# EAGLE board Mtx12BR (EAGLE 7.5.0)
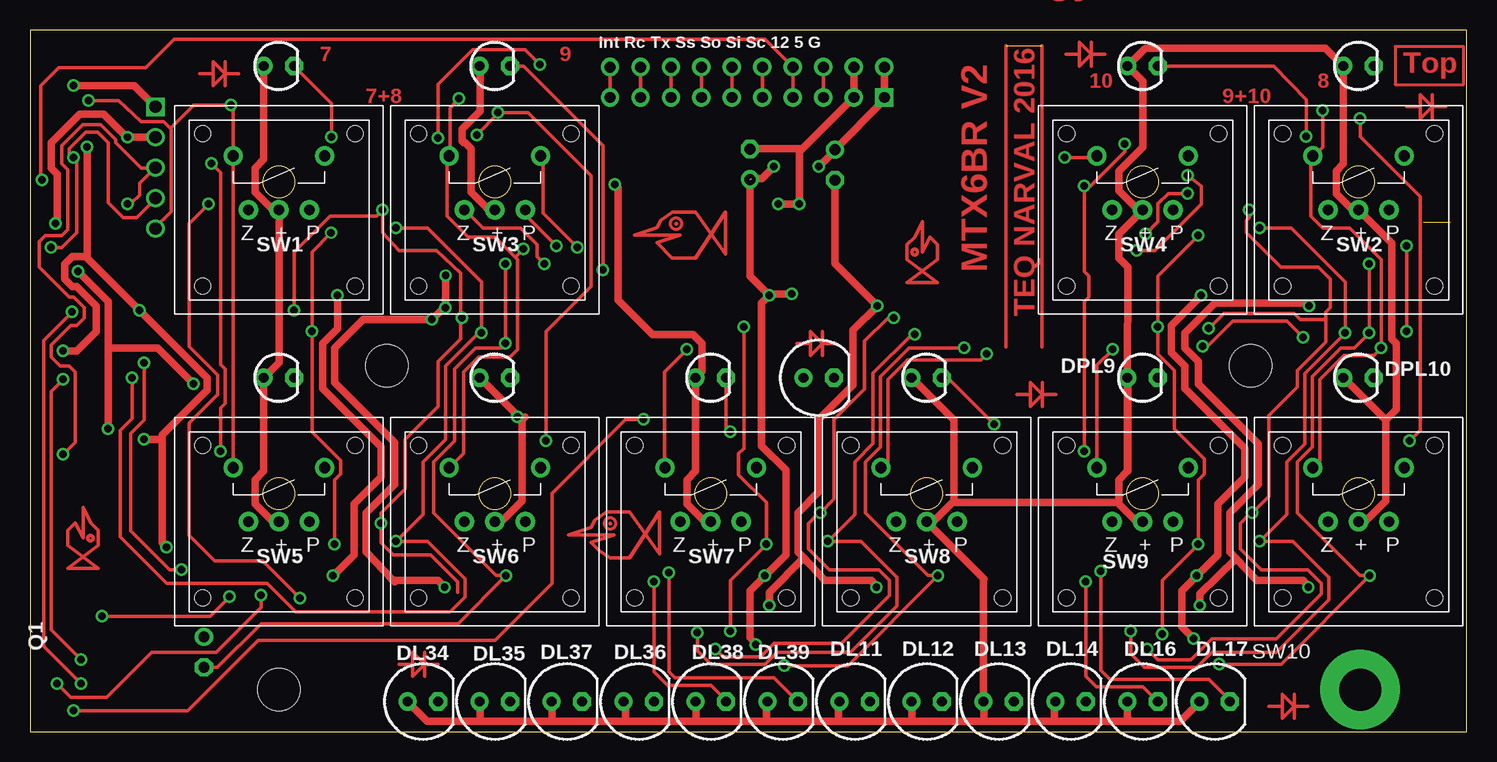
[diagram p2: board, top side]
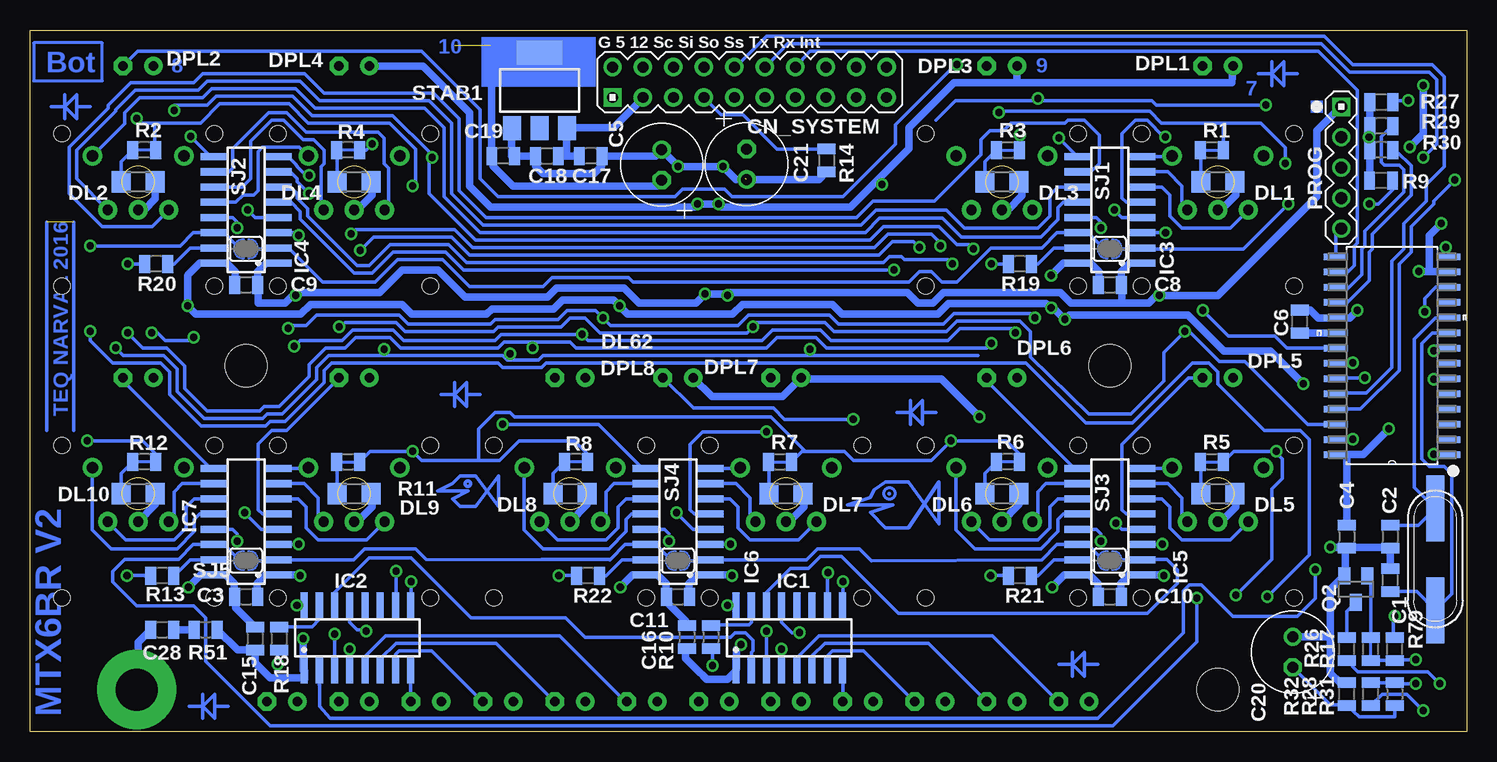
[diagram p3: board, bottom side, seen from below]

Size 119.75 x 58.5 mm. Coordinates in mm from the lower left corner, seen from the top.
Outline: 0,0 119.75,0 119.75,58.5 0,58.5 0,0
Outline: circle at 56.75,19.84 radius 1.33
Outline: circle at 38.75,19.84 radius 1.33
Outline: circle at 74.75,19.84 radius 1.33
Outline: circle at 20.75,19.84 radius 1.33
Outline: circle at 110.75,45.84 radius 1.33
Outline: circle at 38.75,45.84 radius 1.33
Outline: circle at 92.75,19.84 radius 1.33
Outline: circle at 20.75,45.84 radius 1.33
Outline: circle at 92.75,45.84 radius 1.33
Outline: circle at 110.75,19.84 radius 1.33
Copper layers (1*16): Top 0.035mm / dielectric 1.5mm / Bottom 0.035mm
Design rules "default": minimum track width 10mil, minimum drill 23mil, track to track 12mil, track to pad 12mil, pad to pad 12mil, via to via 12mil, smd to smd 0mil, copper to edge 12mil, drill to drill 8mil, minimum pad ring 10mil, minimum via ring 8mil, stop-mask expansion 0mil, vias tented up to drill 0mil, thermal gap 10mil
Net classes: 0 default: width 0.305 mm, clearance 0.305 mm; 1 Tap: width 0.406 mm, clearance 0.305 mm
Holes 3.5 mm at 29.75,30.5 20.75,3.5 101.75,30.5
tRestrict: area 98.2,27 to 105.2,34; area 26.2,27 to 33.2,34; area 17.2,0 to 24.2,7
bRestrict: area 98.2,27 to 105.2,34; area 26.2,27 to 33.2,34; area 17.2,0 to 24.2,7

## Footprints (pad centres in the part's own frame; a part is rotated, then mirrored left to right if it is on the bottom)
R0805 = smd 0.9 x 1.5: 1 -0.953,0; 2 0.953,0
C_EL1RASZT07 = drill 0.914 pad 1.524 octagon: P+ 1.27,0 | drill 0.914 pad 1.524: P- -1.27,0
TESTCSAVAR_3.5 = drill 3.5 pad 6.6: P$1 0,0
PIN10_2 = drill 0.914 pad 1.524 square: 1 -10.16,0 | drill 0.914 pad 1.524: 2 -10.16,2.54; 3 -7.62,0; 4 -7.62,2.54; 5 -5.08,0; 6 -5.08,2.54; 7 -2.54,0; 8 -2.54,2.54; 9 0,0; 10 0,2.54; 11 2.54,0; 12 2.54,2.54; 13 5.08,0; 14 5.08,2.54; 15 7.62,0; 16 7.62,2.54; 17 10.16,0; 18 10.16,2.54; 19 12.7,0; 20 12.7,2.54
R1206 = smd 1.6 x 1.803: 1 -1.422,0; 2 1.422,0
LED5MM = drill 0.813 pad 1.524: A -1.27,0 | drill 0.813 pad 1.524 octagon: K 1.27,0
LED3MM = drill 0.813 pad 1.524: A -1.27,0 | drill 0.813 pad 1.524 octagon: K 1.27,0
SO16 = smd 0.6 x 2.2: 1 -4.445,-2.695; 2 -3.175,-2.695; 3 -1.905,-2.695; 4 -0.635,-2.695; 5 0.635,-2.695; 6 1.905,-2.695; 7 3.175,-2.695; 8 4.445,-2.695; 9 4.445,2.695; 10 3.175,2.695; 11 1.905,2.695; 12 0.635,2.695; 13 -0.635,2.695; 14 -1.905,2.695; 15 -3.175,2.695; 16 -4.445,2.695
SOIC127P1032X265-28N = smd 1.981 x 0.533: 1 -4.699,8.255; 2 -4.699,6.985; 3 -4.699,5.715; 4 -4.699,4.445; 5 -4.699,3.175; 6 -4.699,1.905; 7 -4.699,0.635; 8 -4.699,-0.635; 9 -4.699,-1.905; 10 -4.699,-3.175; 11 -4.699,-4.445; 12 -4.699,-5.715; 13 -4.699,-6.985; 14 -4.699,-8.255; 15 4.699,-8.255; 16 4.699,-6.985; 17 4.699,-5.715; 18 4.699,-4.445; 19 4.699,-3.175; 20 4.699,-1.905; 21 4.699,-0.635; 22 4.699,0.635; 23 4.699,1.905; 24 4.699,3.175; 25 4.699,4.445; 26 4.699,5.715; 27 4.699,6.985; 28 4.699,8.255
PIN05_1 = drill 1.016 square: 1 -5.08,0 | drill 1.016: 2 -2.54,0; 3 0,0; 4 2.54,0; 5 5.08,0
XTAL_NAGYSMD = smd 5.5 x 1.5: P$1 -4.25,0; P$2 4.25,0
SOT23 = smd 1 x 1.4: 1 -0.95,-1.1; 2 0.95,-1.1; 3 0,1.1
R0805_C = smd 0.9 x 1.5: 1 -0.953,0; 2 0.953,0
SJ = smd 0.508 x 0.508: 1 -0.762,0; 2 0.762,0; 3 -0.762,0; 4 0.762,0
SOT223 = smd 1.5 x 2: 1 -2.3,-3.15; 2 0,-3.15; 3 2.3,-3.15 | smd 3.8 x 2: 4 0,3.15
SPG2_3LED = drill 0.95 pad 1.6: G1 -3.81,4.5; G2 3.81,4.5 | drill 0.85 pad 1.6: LED+ 0,0; P- 2.54,0; Z- -2.54,0 | hole 1.35: 6.35,6.35; -6.35,6.35; -6.35,-6.35; 6.35,-6.35

## Placement (x,y rotation side)
C1  22  [R0805]  6.38,12.62 90 bottom
C2  22  [R0805]  6.38,16.25 270 bottom
C3  100n  [R0805]  101.75,11.25 0 bottom
C4  100n  [R0805]  10,16.25 270 bottom
C5  100u  [C_EL1RASZT07]  67.1,47.26 270 bottom
C6  1u  [R0805]  13.92,34.19 90 bottom
C8  100n  [R0805]  29.75,37.25 0 bottom
C9  100n  [R0805]  101.75,37.25 0 bottom
C10  100n  [R0805]  29.75,11.25 0 bottom
C11  100n  [R0805]  65.75,11.25 0 bottom
C15  100n  [R0805]  101,7.75 270 bottom
C16  100n  [R0805]  65,7.88 270 bottom
C17  100n  [R0805]  73.02,48 180 bottom
C18  1u  [R0805]  76.67,48 0 bottom
C19  1u  [R0805]  80.32,48 180 bottom
C20  220u  [C_EL1RASZT07]  14.5,6.62 270 bottom
C21  100u  [C_EL1RASZT07]  60.02,47.3 90 bottom
C28  100n  [R0805]  108.75,8.5 0 bottom
CN1  TESTCSAVAR3.5  [TESTCSAVAR_3.5]  110.88,3.5 0 top
CN_SYSTEM  G 5 12 Sc Si So Ss Tx Rc Int  [PIN10_2]  61.05,52.88 0 bottom
DL1  LED1206  [R1206]  20.75,45.84 180 bottom
DL2  LED1206  [R1206]  110.75,45.84 180 bottom
DL3  LED1206  [R1206]  38.75,45.84 180 bottom
DL4  LED1206  [R1206]  92.75,45.84 180 bottom
DL5  LED1206  [R1206]  20.75,19.84 180 bottom
DL6  LED1206  [R1206]  38.75,19.84 180 bottom
DL7  LED1206  [R1206]  56.75,19.84 180 bottom
DL8  LED1206  [R1206]  74.75,19.84 180 bottom
DL9  LED1206  [R1206]  92.75,19.84 180 bottom
DL10  LED1206  [R1206]  110.75,19.84 180 bottom
DL11  Red  [LED5MM]  68.75,2.5 0 top
DL12  Red  [LED5MM]  74.75,2.5 0 top
DL13  Red  [LED5MM]  80.75,2.5 0 top
DL14  Red  [LED5MM]  86.75,2.5 0 top
DL16  Red  [LED5MM]  92.75,2.5 0 top
DL17  Red  [LED5MM]  98.75,2.5 0 top
DL34  Red  [LED5MM]  32.75,2.5 0 top
DL35  Red  [LED5MM]  38.75,2.5 0 top
DL36  Red  [LED5MM]  44.75,2.5 0 top
DL37  Red  [LED5MM]  50.75,2.5 0 top
DL38  Red  [LED5MM]  56.75,2.5 0 top
DL39  Red  [LED5MM]  62.75,2.5 0 top
DL62  PWR  [LED5MM]  65.75,29.5 0 top
DPL1  LED3MM  [LED3MM]  20.75,55.5 0 top
DPL2  LED3MM  [LED3MM]  110.75,55.5 0 top
DPL3  LED3MM  [LED3MM]  38.75,55.5 0 top
DPL4  LED3MM  [LED3MM]  92.75,55.5 0 top
DPL5  LED3MM  [LED3MM]  20.75,29.5 0 top
DPL6  LED3MM  [LED3MM]  38.75,29.5 0 top
DPL7  LED3MM  [LED3MM]  56.75,29.5 0 top
DPL8  LED3MM  [LED3MM]  74.75,29.5 0 top
DPL9  LED3MM  [LED3MM]  92.75,29.5 0 top
DPL10  LED3MM  [LED3MM]  110.75,29.5 0 top
IC1  SCT2168SOP16  [SO16]  56.47,7.83 0 bottom
IC2  SCT2168SOP16  [SO16]  92.47,7.83 0 bottom
IC3  SCT2168SOP16  [SO16]  29.75,43.5 90 bottom
IC4  SCT2168SOP16  [SO16]  101.75,43.5 90 bottom
IC5  SCT2168SOP16  [SO16]  29.75,17.5 90 bottom
IC6  SCT2168SOP16  [SO16]  65.75,17.5 90 bottom
IC7  SCT2168SOP16  [SO16]  101.75,17.5 90 bottom
PIC1  PIC32MX1XXSOIC  [SOIC127P1032X265-28N]  6.22,31.34 180 bottom
PROG  G +5 M 39 40  [PIN05_1]  10.46,47.02 270 bottom
Q1  20MHz  [XTAL_NAGYSMD]  2.62,14.38 270 bottom
Q2  BC846BSMD  [SOT23]  9.25,11.88 180 bottom
R1  [R0805_C]  21.25,48.5 0 bottom
R2  [R0805_C]  110.25,48.5 180 bottom
R3  [R0805_C]  38.25,48.5 0 bottom
R4  [R0805_C]  93.25,48.5 180 bottom
R5  [R0805_C]  21.25,22.5 0 bottom
R6  [R0805_C]  38.25,22.5 180 bottom
R7  [R0805_C]  57.25,22.5 0 bottom
R8  [R0805_C]  74.25,22.5 180 bottom
R9  2k2  [R0805]  7.14,45.95 180 bottom
R10  2.2k  [R0805]  63,7.88 270 bottom
R11  [R0805_C]  93.25,22.5 0 bottom
R12  [R0805_C]  110.25,22.5 180 bottom
R13  2.2k  [R0805]  108.75,13 180 bottom
R14  220  [R0805]  53.36,47.62 270 bottom
R17  [R0805_C]  8,6.88 90 bottom
R18  2.2k  [R0805]  99,7.75 270 bottom
R19  [R0805]  37.25,39 180 bottom
R20  NOP  [R0805]  109.25,39 180 bottom
R21  [R0805]  37.25,13 180 bottom
R22  [R0805]  73.25,13 180 bottom
R26  [R0805]  10,6.88 90 bottom
R27  4.7k  [R0805]  7.12,52.5 0 bottom
R28  10k  [R0805]  8,3.12 90 bottom
R29  2.2k  [R0805]  7.12,50.5 180 bottom
R30  2.2k  [R0805]  7.12,48.5 180 bottom
R31  330  [R0805]  6,3.12 270 bottom
R32  150  [R0805]  10,3.12 90 bottom
R51  2k2  [R0805]  105.12,8.5 0 bottom
R79  2.2k  [R0805]  6,6.88 90 bottom
SJ1  [SJ]  29.75,40.25 180 bottom
SJ2  [SJ]  101.75,40.25 180 bottom
SJ3  [SJ]  29.75,14.25 180 bottom
SJ4  [SJ]  65.75,14.25 180 bottom
SJ5  [SJ]  101.75,14.25 180 bottom
STAB1  LD117AS33TR  [SOT223]  77.29,53.47 0 bottom
SW1  SPG2  [SPG2_3LED]  20.75,43.5 0 top
SW2  SPG2  [SPG2_3LED]  110.75,43.5 0 top
SW3  SPG2  [SPG2_3LED]  38.75,43.5 0 top
SW4  SPG2  [SPG2_3LED]  92.75,43.5 0 top
SW5  SPG2  [SPG2_3LED]  20.75,17.5 0 top
SW6  SPG2  [SPG2_3LED]  38.75,17.5 0 top
SW7  SPG2  [SPG2_3LED]  56.75,17.5 0 top
SW8  SPG2  [SPG2_3LED]  74.75,17.5 0 top
SW9  SPG2  [SPG2_3LED]  92.75,17.5 0 top
SW10  SPG2  [SPG2_3LED]  110.75,17.5 0 top

## Tracks (layer width: path | path; a pad name or v marks a point on that pad's centre or on a via)
+3V3  (via drill 0.61)
  Top 0.61: 106.62,35.34 106.63,35.33 v106.63,35.49 v106.62,35.5 106.38,35.75 98.75,35.75 96.25,33.25 96.25,32 97.38,30.88 97.38,29 102.38,24 102.38,20.62 100,18.25 100,15 100.56,14.41 | 64.43,14.54 66.25,12.62 70.12,12.62 70.56,12.06 v70.56,12.03 | 64.43,14.54 64,15 64,18.25 65.74,19.99 65.74,26.03 68.6,28.89 68.6,33.48 v70.62,35.5 | 34.62,35.5 34.62,38.03 v34.65,38.03 34.59,38.03 | 34.62,35.5 v34.62,35.34 v34.63,35.33 | 34.62,35.5 v33.5,34.38 27.75,34.38 25.38,32 25.38,29.12 30.38,24.12 30.38,20.62 28,18.25 28,15 30.25,12.62 | 30.25,12.62 34,12.62 34.56,12.06 v34.56,12.03 | 30.38,12.5 30.25,12.62 | v6.5,25.25 6.5,32 | 6.5,32 6.5,35.88 v4,38.38 | PROG.2 v8.13,49.55 v8.12,49.55 8.12,49.5 6.12,51.5 4.12,51.5 1.75,49.12 1.75,47 2.25,46.5 2.25,42.5 2.12,42.5 v2.12,42.38 | 70.62,35.34 70.63,35.33 v70.63,35.49 v70.62,35.5 | 100.56,14.41 102.25,12.62 106.12,12.62 106.56,12.06 v106.56,12.03 | 70.62,35.38 v70.62,35.5 | v97.52,10.52 97.5,10.5 97.5,11.5 100.54,14.41 100.56,14.41 | v61.62,10.52 61.62,11.62 64.43,14.43 64.43,14.54 | C5.P+ 67.1,39.02 v70.62,35.5 | v13.62,29 10.62,32 6.5,32
  Bottom 0.406: C11.1 66.7,11.2 66.62,11.12 | 65.12,9.25 65.12,8.95 C16.1
  Bottom 0.61: C9.1 102.68,38.35 103.38,39.05 IC4.16 105.62,39.05 106.52,38.16 106.62,38.03 v106.62,35.5 | C11.1 66.75,12.35 67.46,13.05 IC6.16 69.54,13.05 v70.56,12.03 70.59,12 70.62,12 | IC1.16 v61.62,10.52 | 65.12,8.86 C16.1 | 97,10.5 96.99,10.49 IC2.16 v97.52,10.52 | 106.5,35.33 106.63,35.37 v106.63,35.51 v106.62,35.5 | 30.68,37.25 30.68,37.2 30.75,37.13 30.75,37.12 | 30.68,37.25 30.68,38.35 31.38,39.05 IC3.16 33.62,39.05 v34.65,38.03 | 30.75,11.21 30.75,11.25 | 30.75,11.25 30.75,12.35 31.46,13.05 IC5.16 33.54,13.05 v34.56,12.03 34.53,12 34.5,12 | 35.06,35.69 43.19,35.69 44.06,34.81 52.06,34.81 52.88,35.62 60.38,35.62 61.19,34.81 69.94,34.81 v70.62,35.5 v70.63,35.51 | 35.06,35.69 34.63,35.37 | 34.63,35.37 v34.63,35.33 | C8.1 30.68,37.25 | C10.1 30.75,11.25 | 35.06,35.69 34.69,35.31 | PIC1.28 10.88,23.12 9.88,23.12 | 9.88,23.12 8.62,23.12 v6.5,25.25 | 3.12,38.38 3.12,41.38 v2.12,42.38 | PIC1.13 1.58,38.38 3.12,38.38 | 3.12,38.38 v4,38.38 | 8.08,49.5 R29.2 R27.1 | 8.08,49.5 8.08,48.55 | 8.08,48.55 8.25,48.38 | v8.13,49.55 8.08,49.5 | R9.2 8.08,45.96 R30.2 8.08,48.55 | C4.1 10,23 9.88,23.12 | v106.62,35.5 105.94,34.81 97.19,34.81 96.38,35.62 88.75,35.62 87.94,34.81 81.69,34.81 81.25,35.25 76.12,35.25 75.38,36 71.12,36 v70.63,35.51 | 34.63,35.37 34.62,35.38 34.5,35.38 v33.5,34.38 33.12,34.75 23.25,34.75 20.25,31.75 16.38,31.75 v13.62,29 | 70.5,35.33 70.63,35.37 v70.63,35.51 | 106.62,12 106.59,12 v106.56,12.03 105.54,13.05 IC7.16 103.46,13.05 102.75,12.35 C3.1 102.7,11.2 102.62,11.12 | 65.12,9.25 66.62,10.75 66.62,11.12 66.62,11.25 | C15.1 102.62,10.33 102.62,11.12 | 102.62,11.12 102.62,11.25
  Bottom 0.61: C5.P+ 67.12,46 67.5,45.5 79.5,45.5 81.15,47.15 C19.2 81.27,55.98 80.62,56.62 77.28,56.62 | 77.25,56.62 77.28,56.62 | 77.28,56.62 STAB1.4
+5V  (via drill 0.61)
  Top 0.61: SW7.LED+ 56.25,17.5 54.75,19 54.75,21 55.48,21.73 DPL7.A 56,30.02 56,32.38 55.25,33.12 51.88,33.12 49,35.98 49,45.38 v48.75,45.62 | 76.88,19.12 77,19.25 77,26 73.5,29.5 | 76.88,19.12 75.25,17.5 SW8.LED+ 79.5,12.75 79.48,12.73 DL13.A 79.5,2.48 79.5,0.88 | 73.5,29.62 73.5,29.5 | 73.5,29.5 DPL8.A | SW5.LED+ 20.25,17.5 18.75,19 18.75,21 19.48,21.73 DPL5.A 20.75,30.77 SW1.LED+ 20.25,43.5 18.75,45 18.75,47 19.48,47.73 DPL1.A | SW6.LED+ 39.25,17.5 41,19.25 41,26 41.25,26.25 v40.62,26.25 40.38,26.5 40.38,26.62 37.5,29.5 DPL6.A | CN_SYSTEM.4 CN_SYSTEM.3 68.62,52.88 64.25,48.5 64.12,48.62 | 90.75,19.12 90.75,21 91.48,21.73 DPL9.A | 90.75,19.12 90.75,19 92.25,17.5 SW9.LED+ | SW10.LED+ 111.25,17.5 113,19.25 113,26 | 109.5,29.62 109.5,29.5 | 109.5,29.5 113,26 | 109.5,29.5 DPL10.A | 37.5,0.88 33.1,0.88 DL34.A | 37.5,0.88 43.5,0.88 | 43.5,0.88 49.62,0.88 | 49.62,0.88 55.5,0.88 | 55.5,0.88 61.38,0.88 | 61.38,0.88 67.38,0.88 | 67.38,0.88 73.5,0.88 | 73.5,0.88 79.5,0.88 | 79.5,0.88 85.38,0.88 | 85.38,0.88 91.75,0.88 | 91.75,0.88 95.88,0.88 97.5,2.5 DL17.A | DL14.A 85.38,2.4 85.38,0.88 | DL12.A 73.5,2.48 73.5,0.88 | DL11.A 67.38,2.4 67.38,0.88 | DL39.A 61.38,2.4 61.38,0.88 | DL38.A 55.5,2.48 55.5,0.88 | DL37.A 49.62,2.35 49.62,0.88 | DL36.A 43.5,2.48 43.5,0.88 | DL35.A 37.5,2.48 37.5,0.88 | DL16.A 91.48,1.15 91.75,0.88 | 113,26 113.88,26.88 113.88,32.38 113.5,32.75 113.5,40.75 SW2.LED+ 110.25,43.5 108.88,44.88 108.88,46.75 109.48,47.35 DPL2.A 107.98,57 93,57 92.88,56.9 DPL4.A 91.5,55.5 92.75,54.25 92.75,48.75 90.75,46.75 90.75,45.12 92.12,43.75 92.5,43.75 SW4.LED+ 90.75,41.5 90.75,39.5 91.5,38.75 DPL9.A
  Top 0.61: v62.38,44 v64.12,44 64.12,48.62 | 64.12,48.62 60,48.62 60,48.6 C21.P+ | 90.75,19.12 76.88,19.12 | DPL9.A 91.5,29.48 91.5,21.75 | SW3.LED+ 38.25,43.5 36.75,45 36.75,48.62 36.25,49.12 36.12,49.12 36,49.25 36,50.25 37.5,51.75 37.5,55.5 DPL3.A
  Bottom 0.305: DL7.1 55.25,19.92 | DL1.1 19.25,45.92 | DL5.1 19.25,19.92 | DL9.1 91.25,19.92
  Bottom 0.61: STAB1.3 74.6,50.08 | C18.2 75.12,48 | 75.12,48 C17.2 74.22,48.18 | STAB1.3 74.99,49.84 74.99,49.95 75.05,49.85 | STAB1.3 74.99,50.29 | 91.25,45.92 91.25,44.75 92.5,43.5 SW4.LED+ | 55.25,19.92 55.25,18.75 56.5,17.5 SW7.LED+ | DL8.1 73.33,18.92 SW8.LED+ | 75.05,49.85 75.01,50.04 | 19.25,45.92 19.25,44.75 20.5,43.5 SW1.LED+ | 19.25,19.92 19.25,18.75 20.5,17.5 SW5.LED+ | 37.12,54.11 19.57,54.11 19.48,55.15 DPL1.A | DL6.1 37.33,18.92 SW6.LED+ | 37.5,54.11 42.76,54.11 46.5,50.38 46.5,48.62 49.25,45.88 | 37.5,54.11 37.12,54.11 | 68.62,52.88 CN_SYSTEM.3 68.67,52.83 71.12,50.38 74.93,50.38 STAB1.3 | 75.12,50.25 75.06,50.31 STAB1.3 | 75.05,49.85 75.05,48.08 75.12,48 | 30.88,54.12 37.11,54.12 37.12,54.11 | 91.25,19.92 91.25,19.62 | 91.25,19.62 91.25,18.75 92.5,17.5 SW9.LED+ | DL10.1 109.33,18.92 SW10.LED+ | 91.5,55.5 DPL4.A 87,55.5 83.12,51.62 83.12,45.5 81.38,43.75 64.38,43.75 v64.12,44 v62.38,44 62.12,43.75 51.38,43.75 49.25,45.88 | v48.75,45.62 49.12,45.88 49.25,45.88 | DL2.1 109.33,44.42 110.25,43.5 SW2.LED+ | SW3.LED+ 38.25,43.5 37.06,44.69 37.06,45.58 DL3.1 | DPL3.A 37.48,54.13 37.5,54.11 | 40.62,26.38 v40.62,26.25 43.78,29.41 55.38,29.41 DPL7.A 57.04,27.94 62.92,27.94 DL62.A | DL10.1 | DL9.1 91.33,19.7 91.25,19.62 | 91.25,45.92 | 91.25,45.92 DL4.1
+12V
  Top 0.305: CN_SYSTEM.5 CN_SYSTEM.6
GND  (via drill 0.61)  (1 unrouted)
  Top 0.406: 61.34,12.91 v61.25,13 | 97.34,12.91 v97.25,13
  Top 0.61: v25.25,13 27,14.75 27,19 29.25,21.25 29.25,23.75 24.38,28.62 24.38,32.38 25.62,33.62 v25.62,36.38 | CN_SYSTEM.2 CN_SYSTEM.1 71.21,52.59 71.16,52.59 C5.P- 67.12,48.51 67.12,48.5 v65.75,47.12 | 97.5,36.5 v97.62,36.38 95.12,33.88 95.12,31.62 96.25,30.5 96.25,28.62 101.25,23.62 101.25,21.25 99,19 99,14.75 v97.25,13 96,11.75 96,8.75 v97,7.75 | v9.12,35.12 14.75,29.5 14.75,28.5 11,24.75 11,24.38 | v9.5,24.38 11,24.38 | v2.75,31.75 3.88,31.75 5.5,33.38 5.5,35.5 3.88,37.12 3.5,37.12 2.88,37.75 2.88,39 3.5,39.62 4.5,39.62 4.75,39.5 | 9.11,35.15 v9.12,35.12 | v9.12,35.12 4.75,39.5 | 4.75,39.5 v4.75,48.75 | PROG.1 8.68,53.88 v3.62,53.88 | 11,24.38 11,15.75 v11.38,15.38 | 61.5,36.5 v61.62,36.38 | v60.5,7.25 60,7.88 60,11.75 v61.25,13 63,14.75 63,21.79 60.98,23.81 60.98,35.73 v61.62,36.38 | v61.62,36.38 60.02,37.98 C21.P- | v63.5,36.5 61.75,36.5 v61.62,36.38 | v62,47.12 61,46.12 60.12,46.12 59.88,45.88
  Bottom 0.406: IC1.1 60.92,5.21 60.88,5.25
  Bottom 0.61: IC4.1 100.07,39.05 100.77,38.35 C9.2 100.75,37.06 100.75,35.75 98.5,35.75 97.75,36.5 | C11.2 64.85,12.35 64.14,13.05 IC6.1 61.3,13.05 v61.25,13 | 79.5,50.31 STAB1.1 79.34,50.31 79.62,50.28 79.62,48 C19.1 C18.1 77.87,48 77.62,47.83 77.62,47.14 77.01,46.53 72.74,46.53 72.13,47.14 | 72.13,47.14 72.16,47.73 C17.1 67.62,48 C5.P- 65.73,47.16 | 72.13,47.74 72.13,47.62 72.13,47.14 | C16.2 65.12,6.79 65.12,6.12 64.12,5.12 63.49,4.51 63.62,4.62 63.38,4.38 61.62,4.38 60.92,5.08 IC1.1 | C15.2 101.03,6.84 101,6.88 C15.2 | 101.14,6.75 C15.2 | 97.75,36.5 97.62,36.62 90.62,36.62 88.75,38.5 85.75,38.5 83.5,36.25 76.62,36.25 75.88,37 70.25,37 69,35.75 64.25,35.75 v63.5,36.5 61.75,36.5 v61.62,36.38 61.38,36.62 46.62,36.62 45.75,35.75 44.5,35.75 43.62,36.62 33.88,36.62 33,35.75 28.75,35.75 | v97.62,36.38 97.75,36.5 | IC3.1 28.07,39.05 28.77,38.35 28.77,37.25 | 28.77,37.25 28.77,37.2 28.75,37.06 28.75,35.75 | 28.85,11.21 28.85,11.25 | 28.85,11.25 28.85,12.35 28.14,13.05 IC5.1 25.3,13.05 v25.25,13 25.34,12.91 25.21,12.84 | 28.75,35.75 26.5,35.75 25.75,36.5 | 25.75,36.5 25.62,36.62 | 25.75,36.5 v25.62,36.38 20.75,36.38 12.5,44.62 12.5,50.12 10.5,52.12 PROG.1 | C8.2 28.77,37.25 | C10.2 28.85,11.25 | C15.2 101,5.75 99.75,4.5 97,4.5 96.88,4.38 96.88,5.06 IC2.1 97,5.12 v97,7.75 | PIC1.27 10.9,24.38 v9.5,24.38 | PIC1.8 1.55,32 2.5,32 v2.75,31.75 | v9.12,35.12 9.75,34.5 PIC1.19 12.38,34.5 13.02,35.15 C6.2 | C1.2 C2.2 6.45,15.38 10,15.38 10.06,15.31 | v4.75,48.75 3.62,49.88 v3.62,53.88 | 10.06,15.31 10.12,15.25 10.12,13.12 | 10.12,13.12 10.12,13.05 Q2.2 | R32.2 10.58,4.12 11.38,4.88 11.38,8
  Bottom 0.61: 11.38,8 11.38,11.88 10.12,13.12 | v11.38,15.38 10.08,15.38 C4.2 10.05,15.3 10.06,15.31 | C3.2 100.85,12.35 100.14,13.05 IC7.1 97.31,13.05 v97.25,13 | v60.5,7.25 60.88,6.88 60.88,5.25 | R51.2 102.47,6.8 C15.2 | C20.P- 11.48,7.89 11.38,8 | 60.91,46.03 v62,47.12 v65.75,47.12 | R14.2 54,46.03 C21.P-
HALACSKA1
  Bottom 0.305: 48.13,16.98 46.54,16.98 44,20.8 44,17.3 46.54,20.8 48.45,20.8 49.4,20.16 49.72,19.52 51.62,18.89 47.81,18.89 49.72,18.25 48.46,17 48,17
HALACSKA3
  Top 0.305: 53.87,39.48 55.46,39.48 58,43.3 58,39.8 55.46,43.3 53.55,43.3 52.6,42.66 52.28,42.02 50.38,41.39 54.19,41.39 52.28,40.76 53.54,39.5 54,39.5
HALACSKA4
  Bottom 0.305: 80.72,21.31 80.72,18.77 82.63,21.31 83.9,21.31 84.53,20.68 85.8,20.04 83.26,20.04 84.53,19.41 83.9,18.77 82.63,18.77 80.72,21.31
HALACSKA5
  Top 0.305: 52.5,18.3 52.5,14.8 49.96,18.3 48.05,18.3 47.1,17.66 46.78,17.02 44.88,16.39 48.69,16.39 46.78,15.76 47.42,15.12 48.37,14.48 49.96,14.48 52.5,18.3
HALACSKA6
  Top 0.305: 5.69,13.6 3.15,13.6 5.69,15.5 5.69,16.77 5.05,17.41 4.42,18.68 4.42,16.14 3.78,17.41 3.15,16.77 3.15,15.5 5.69,13.6
HALACSKA8
  Top 0.305: 73.12,37.44 75.66,37.44 73.12,39.34 73.12,40.62 73.75,41.25 74.39,42.52 74.39,39.98 75.02,41.25 75.66,40.62 75.66,39.34 73.12,37.44
N$1
  Bottom 0.305: PIC1.9 1.53,33.25 2.88,33.25 3.75,32.38 3.75,22.75 3.12,22.12 1.88,22.12 1.25,21.5 1.25,11.5 Q1.P$2 4.17,11.67 C1.1
N$2
  Bottom 0.305: PIC1.10 1.53,34.5 2.62,34.5 4.38,32.75 4.38,20.38 Q1.P$1 4.05,17.2 C2.1
N$3  (via drill 0.61)
  Top 0.305: v111.62,39 v111.62,33.25 110.38,32 109.25,32 106.88,29.62 106.88,23.75 105.62,22.5 105.62,18.25 110.87,13 v111.68,13 | v75.68,13 74.87,13 69.62,18.25 69.62,22.5 70.88,23.75 70.88,29.62 73.25,32 v77.88,32 | v39.62,39 v39.62,32.38 39.25,32 37.12,32 35.38,30.25 35.38,24.25 33.62,22.5 33.62,18.25 38.87,13 v39.68,13 35.68,9 19.25,9 15.61,5.36 C20.P+ | 75.75,13 v75.68,13 | 111.75,13 v111.68,13 | 62.75,5.38 v62.88,5.5 68.18,5.5 v75.68,13 | v99.12,5.62 104.3,5.62 v111.68,13
  Bottom 0.305: R20.2 v111.62,39 | R22.2 v75.68,13 | 98.83,7 R18.2 99.12,6.7 v99.12,5.62 | 62.62,6.88 62.88,7.12 63,7 | 63,7 63.12,6.88 63,6.88 | 63,6.88 R10.2 63,7 | R19.2 v39.62,39 | R21.2 v39.68,13 | 39.62,32.12 v39.62,32.38 40,32 53.38,32 54.25,32.88 57.5,32.88 58.38,32 74.25,32 74.75,32.5 77.88,32.5 | v62.88,5.5 62.88,7 63,6.88 | R31.2 6,1.25 8.95,1.25 R32.1 10.08,2.25 11.38,2.25 14.48,5.36 C20.P+ | v111.62,33.25 110.38,32 108.38,32 106.88,30.5 106.88,28.62 105,26.75 100.62,26.75 100.25,27.12 99,27.12 96.5,29.62 96.5,30.62 95.12,32 93.5,32 92.62,32.88 89.75,32.88 88.88,32 80.75,32 80.25,32.5 77.88,32.5 | v111.68,13 110.2,13 R13.2 | v77.88,32 77.88,32.5
N$4
  Bottom 0.305: IC5.8 24.61,21.95 SW5.G2
N$5
  Bottom 0.305: SW9.P- 95.29,17.54 95.75,18 95.75,19.5 96.92,20.68 IC7.7
N$6
  Bottom 0.305: IC1.5 55.84,6.16 54,8 39.52,8 DL34.K
N$7
  Bottom 0.305: SW5.P- 23.29,17.54 23.75,18 23.75,19.5 24.93,20.68 IC5.7
N$8
  Bottom 0.305: IC1.6 54.57,6.31 53.5,7.38 44.88,7.38 40.12,2.62 40.02,2.52 | 40.02,2.52 40,2.5 | DL35.K 40.02,2.52
N$9
  Bottom 0.305: Q2.1 8,12.68 R17.2
N$10
  Bottom 0.305: SW6.Z- 35.75,17.96 35.75,20 35.08,20.68 IC5.10
N$11
  Bottom 0.305: SW5.Z- 19.71,16 23.75,16 24.75,17 24.75,18.75 25.41,19.41 IC5.6
N$12
  Bottom 0.305: IC5.11 34.09,19.41 34.75,18.75 34.75,17 35.75,16 39.79,16 SW6.P-
N$13
  Bottom 0.305: SW9.Z- 91.71,16 95.75,16 96.75,17 96.75,18.75 97.41,19.41 IC7.6
N$14
  Bottom 0.305: SW6.G2 42.56,16.81 41,15.25 35.5,15.25 34.06,16.69 34.06,17.69 33.62,18.14 IC5.12
N$15
  Bottom 0.305: SW10.Z- 107.75,17.96 107.75,20 107.08,20.68 IC7.10
N$16
  Bottom 0.305: IC7.11 106.09,19.41 106.75,18.75 106.75,17 107.75,16 111.79,16 SW10.P-
N$17
  Bottom 0.305: IC5.5 28.39,18.14 28.75,18.5 28.75,23.93 23.18,29.5 DPL5.K
N$18
  Bottom 0.305: DL6.2 40.17,21.53 R6.2
N$19
  Bottom 0.305: IC5.9 32.7,21.95 40.02,29.27 DPL6.K
N$20
  Bottom 0.305: R5.1 22.17,22.47 DL5.2
N$21
  Bottom 0.305: IC2.15 95.65,9.35 96.25,8.75 98.75,8.75 98.88,8.88 98.98,8.77 R18.1
N$22
  Bottom 0.305: SW10.G2 114.56,16.81 113,15.25 107.5,15.25 106.06,16.69 106.06,17.69 105.61,18.14 IC7.12
N$23
  Bottom 0.305: R1.1 22.17,48.47 DL1.2
N$24  (via drill 0.61)
  Top 0.305: v34,49.5 34,54 36.88,56.88 41.25,56.88 v42.5,55.62
  Bottom 0.305: IC3.9 32.7,47.95 32.7,48.2 v34,49.5 | DPL2.K 110.77,56.75 87.12,56.75 82.25,51.88 82.25,46.12 80.75,44.62 66,44.62 65.38,45.25 61.88,45.25 61.25,44.62 52,44.62 47.62,49 47.62,50.62 42.62,55.62 v42.5,55.62
N$25
  Bottom 0.305: DL2.2 112.17,47.53 R2.2
N$26
  Bottom 0.305: IC7.8 96.61,21.95 SW9.G2
N$27  (via drill 0.61)
  Top 0.305: v96.5,44.88 94.88,44.88 94.03,44.03 94.03,42.53 v93,41.5 | v43.88,40.5 41.25,43.12 41.25,43.5 SW3.P-
  Bottom 0.305: IC4.7 99,46.62 98,46.62 97.5,46.12 97.5,45.88 v96.5,44.88 | v93,41.5 92.62,41.88 84.38,41.88 82.88,40.38 49.38,40.38 48.25,41.5 44.62,41.5 43.88,40.75 v43.88,40.5
N$28  (via drill 0.61)
  Top 0.305: v42.88,39 42.25,39.62 42.25,40.62 40.88,42 37.75,42 36.25,43.5 SW3.Z-
  Bottom 0.305: IC4.6 98.03,45.41 97.5,44.88 97.5,44.5 96.62,43.62 96.62,43 92.5,38.88 91.5,38.88 89.75,40.62 84.88,40.62 83.38,39.12 48.62,39.12 48.12,39.62 47.12,39.62 46.88,39.38 43.25,39.38 v42.88,39
N$29
  Bottom 0.305: SW1.P- 23.29,43.54 23.75,44 23.75,45.5 24.93,46.67 IC3.7
N$30
  Bottom 0.305: SW1.Z- 19.71,42 23.75,42 24.75,43 24.75,44.75 25.41,45.41 IC3.6
N$31
  Bottom 0.305: SW2.Z- 109.58,42.12 113.75,42.12 116.5,44.88 116.5,48.75 113.25,52 113.25,52.25 111.38,54.12 106.12,54.12 105.38,54.88 96.88,54.88 95.25,53.25 86.12,53.25 84,51.12 84,45.12 81.75,42.88 50.88,42.88 49.5,44.25 44.38,44.25 40.5,48.12 40.5,49.38 39.75,50.12 38.62,50.12 38,50.75 33.5,50.75 33.25,51 31.88,51 30.62,49.75 30.62,47.38 31.33,46.67 IC3.10
N$32
  Bottom 0.305: IC3.11 34.09,45.41 34.75,44.75 34.75,43 35.75,42 41.88,42 43.38,43.5 49.25,43.5 50.5,42.25 82,42.25 84.62,44.88 84.62,50.75 86.5,52.62 95.62,52.62 97.25,54.25 105,54.25 105.75,53.5 111,53.5 112.62,51.88 112.62,51.75 115.88,48.5 115.88,46.09 SW2.P-
N$33  (via drill 0.61)
  Top 0.305: v2.75,29.38 1.75,28.38 1.75,8.5 v4.25,6
  Bottom 0.305: PIC1.6 1.59,29.5 v2.75,29.38 | R17.1 R79.1 5.92,6 v4.25,6
N$34  (via drill 0.61)
  Top 0.305: v3.62,1.75 13.12,1.75 19,7.62 38.75,7.62 43.5,12.38 43.5,19.88 49.66,26.04 v51.14,26.04
  Bottom 0.305: R28.1 7.05,3.12 5,3.12 v3.62,1.75 | v51.14,26.04 56.85,26.04 57.8,26.99 64.47,26.99 66.98,29.5 DL62.K
N$35
  Bottom 0.305: PIC1.18 10.89,35.75 10,35.75 8.12,37.62 8.12,40 7.88,40.25 7.88,41.5 4.62,44.75 4.62,47.17 5.83,48.38 6.2,48.38 6.25,48.42 R30.1
N$36
  Bottom 0.305: PIC1.17 10.87,37 9.88,37 8.75,38.12 8.75,40.25 8.5,40.5 8.5,41.75 5.25,45 5.25,46.88 5.62,47.25 6.88,47.25 7.12,47.5 7.12,49.62 6.25,50.5 R29.1
N$37
  Bottom 0.305: IC1.15 59.62,10.5 59.62,9.12 59.84,8.9 62.84,8.9 62.97,8.78 | 62.97,8.78 63,8.75 | R10.1 62.97,8.78
N$38
  Bottom 0.305: IC1.7 53.25,5.18 53.25,6.38 52.88,6.75 50.27,6.75 DL36.K
N$39
  Bottom 0.305: IC1.8 52,5.11 52,2.5 DL37.K
N$40  (via drill 0.61)
  Top 0.305: DL38.K 58.02,2.6 56.75,3.88 53.12,3.88 52,5 v52,12.5
  Bottom 0.305: v52,12.5 52,10.55 IC1.9
N$41  (via drill 0.61)
  Top 0.305: v2.75,23.12 3.75,24.12 3.75,30 3.25,30.5 2.5,30.5 1.75,31.25 1.75,32.25 3.38,33.88 3.88,33.88 4.5,34.5 4.5,35.38 3.62,36.25 3.25,36.25 0.75,38.75 0.75,40.88 1.25,41.38 2.62,41.38 3.12,41.88 3.12,46.88 2.62,47.38 2.62,48.88 4.38,50.62 5.88,50.62 7.12,49.38 7.12,49.12 9.25,47 10.38,47 | PROG.3 10.39,47.02 10.38,47 | 10.38,47 9.12,45.75 9.12,44.75 8.44,44.06 8.19,43.94 v8.12,44
  Bottom 0.305: PIC1.1 1.57,23.12 v2.75,23.12 | R9.1 6.12,45.89 6.12,45.25 7.38,44 v8.12,44
N$42
  Top 0.305: CN_SYSTEM.15 CN_SYSTEM.16
N$43
  Bottom 0.305: IC3.12 33.62,44.13 34.06,43.69 34.06,42.69 35.5,41.25 42.12,41.25 43.69,42.81 48.94,42.81 50.12,41.62 82.25,41.62 85.25,44.62 85.25,50.38 86.88,52 96,52 97.62,53.62 104.62,53.62 105.38,52.88 110.62,52.88 111.88,51.62 111.88,50.69 SW2.G2
N$44
  Top 0.305: CN_SYSTEM.17 CN_SYSTEM.18
N$45
  Top 0.305: CN_SYSTEM.19 CN_SYSTEM.20
N$46  (via drill 0.61)
  Top 0.305: v53.25,13.25 53.25,5 53.75,4.5 62.02,4.5 DL39.K
  Bottom 0.305: IC1.10 53.3,13.58 v53.25,13.25
N$47
  Bottom 0.305: IC7.5 100.39,18.14 100.75,18.5 100.75,24 99.62,25.12 98.38,25.12 94,29.5 DPL9.K
N$48
  Bottom 0.305: IC7.9 104.69,21.95 112.02,29.27 DPL10.K
N$49
  Bottom 0.305: 71.5,14.38 71.38,14.38 70.16,15.6 IC6.14 67.59,15.6 66.5,14.5 66.5,14.26 SJ4.2 | 71.5,14.38 77.12,14.38 | SJ5.3 100.88,14.25 99.13,14.25 IC7.2 92.8,14.32 91.88,15.25 87.62,15.25 86.75,14.38 71.42,14.32 71.45,14.32 71.5,14.38
N$50
  Bottom 0.305: IC3.8 24.61,47.95 SW1.G2
N$51
  Bottom 0.305: DL10.2 112.17,21.53 R12.2
N$53  (via drill 0.61)
  Top 0.305: v9.5,30.75 9.5,26 8.38,24.88 8.38,16.75 11.62,13.5 v12.62,13.5
  Bottom 0.305: PIC1.22 10.87,30.75 v9.5,30.75 | 95.65,3.9 IC2.2 95.63,5.13 95.62,5.12 95.62,2.12 94.75,1.12 30.75,1.12 23.62,8.25 23.62,11.75 23.12,12.25 22.12,12.25 19.5,9.62 14.12,9.62 12.62,11.12 v12.62,13.5
N$54
  Bottom 0.305: 59.62,5.16 IC1.2 59.62,5.11 59.62,6.62 59.5,6.75 59.5,7.62 60.12,8.25 61,8.25 61.38,7.88 73.5,7.88 75.12,9.5 83,9.5 88,14.5 91.5,14.5 94.38,11.62 IC2.14
N$56
  Bottom 0.305: R11.1 94.17,22.47 DL9.2
N$57  (via drill 0.61)
  Top 0.305: v14.88,44 13.25,42.38 13.25,32.12 15.62,29.75 15.62,28.12 13.25,25.75 13.25,16.38 15.38,14.25 19.38,14.25 v22.5,11.12
  Bottom 0.305: SJ5.2 102.5,14.26 102.5,14.5 103.59,15.6 IC7.14 106.16,15.6 107.38,14.38 111.88,14.38 112.88,13.38 112.88,12.5 110.88,10.5 106.12,10.5 105.12,9.5 105.12,5.88 99.75,0.5 29.5,0.5 22.5,7.5 v22.5,11.12 | SJ1.3 18.62,40.25 v14.88,44 | IC3.2 27.13,40.25 SJ1.3 | SJ1.3
N$58  (via drill 0.61)
  Top 0.305: v25.12,49.59 25.12,52.38 22,55.5 DPL1.K
  Bottom 0.305: v25.12,49.59 25.28,49.59 26.62,51 27.62,51 28.75,49.88 28.75,44.5 28.39,44.13 IC3.5
N$59
  Bottom 0.305: IC4.10 104.39,46.62 103.25,46.62 102.88,47 102.88,48.62 99.88,51.62 98.38,51.62 96.75,50 90.75,50 90.25,49.5 90.25,47.38 89.88,47 89.88,43.84 SW4.Z-
N$60
  Bottom 0.305: 107.55,12.88 R13.1 107.75,13 106.42,14.32 IC7.15
N$61
  Bottom 0.305: IC2.5 91.84,6.29 90.12,8 75.62,8 70,2.38
  Bottom 0.406: 70,2.38 70,2.48 DL11.K
N$62
  Bottom 0.61: C6.1 PIC1.20
N$63
  Bottom 0.305: SJ1.2 30.51,40.51 31.59,41.59 IC3.14 34.16,41.59 35.42,40.33 39.67,40.33 42.5,37.5 43.75,37.5 44.62,38.38 45.62,38.38 46.5,37.5 69.5,37.5 69.88,37.88 76.25,37.88 77,37.12 83.12,37.12 85.38,39.38 89.12,39.38 91,37.5 95.38,37.5 98.12,40.25 IC4.2 99.13,40.25 SJ2.3
N$64
  Bottom 0.305: IC4.11 102.09,45.41 101.38,46.12 101.38,49.25 99.62,51 98.62,51 97,49.38 96.12,49.38 95.25,48.5 95.25,47.38 95.5,47.12 95.5,43.71 SW4.P-
N$65
  Bottom 0.305: IC4.12 102.61,44.13 102,44.75 101.12,44.75 100.75,45.12 100.75,48.38 100.41,48.72 97.34,48.72 96.62,48 SW4.G2
N$66  (via drill 0.61)
  Top 0.305: v96.5,46.38 97.62,45.5 97.62,44 93.75,40.12 v92.25,40.12 | v45.62,40.38 42.75,43.25 42.75,47.75 42.56,47.94 SW3.G2
  Bottom 0.305: IC4.8 98.26,47.95 97.59,47.28 97.59,47.25 97.5,47.16 97.5,47.12 96.75,46.38 v96.5,46.38 | v92.25,40.12 91.12,41.25 84.62,41.25 83.12,39.75 49,39.75 47.88,40.88 46.12,40.88 v45.62,40.38
N$67  (via drill 0.61)
  Top 0.305: v47.75,38.5 47.75,48.88 41.12,55.5 DPL3.K 40,55.5
  Bottom 0.305: IC4.5 98.01,44.13 97.25,43.38 97.25,42.75 92.75,38.25 91.25,38.25 89.5,40 85.12,40 83.62,38.5 v47.75,38.5
N$70
  Bottom 0.305: SW7.P- 59.29,17.54 59.75,18 59.75,19.5 60.92,20.68 IC6.7
N$71
  Bottom 0.305: Q2.3 10,10.03 R26.2
N$72  (via drill 0.61)
  Top 0.305: v3.5,35 1.12,32.62 1.12,7.12 v4.25,4
  Bottom 0.305: PIC1.12 2.58,37.05 3.5,36.12 v3.5,35 | v4.25,4 5.92,4 R31.1 7.78,4.05 7.95,4.05 | 7.95,4.05 8,4 | R28.2 7.98,4.08 7.95,4.05
N$73
  Bottom 0.305: IC2.6 90.57,6.06 89.25,7.38 80.89,7.38 DL12.K
N$74
  Bottom 0.305: SW7.Z- 55.71,16 59.75,16 60.75,17 60.75,18.75 61.41,19.41 IC6.6
N$75
  Bottom 0.305: SW8.Z- 71.75,17.96 71.75,20 71.08,20.68 IC6.10
N$76
  Bottom 0.305: IC6.11 70.09,19.41 70.75,18.75 70.75,17 71.75,16 75.79,16 SW8.P-
N$77
  Bottom 0.305: SW8.G2 78.56,16.81 77,15.25 71.5,15.25 70.06,16.69 70.06,17.69 69.61,18.14 IC6.12
N$78
  Bottom 0.305: IC6.8 60.62,21.95 SW7.G2
N$79  (via drill 0.61)
  Top 0.305: v58.38,25 58,25.38 58,29.5 DPL7.K
  Bottom 0.305: IC6.5 64.39,18.14 64.75,18.5 64.75,23.93 63.68,25 v58.38,25
N$80
  Bottom 0.61: C28.1 110.75,7.45 110.75,3.5 CN1.P$1
N$81  (via drill 0.61)
  Top 0.305: v114.75,33.38 v114.75,40.5 | v16.62,11.25 15,9.62 v6,9.62
  Bottom 0.305: v114.75,40.5 107.25,40.5 106.16,41.59 IC4.14 103.59,41.59 102.5,40.5 102.5,40.26 SJ2.2 | v114.75,33.38 114.75,32.62 112.88,30.75 108.88,30.75 108.12,30 108.12,28.12 105.5,25.5 100.12,25.5 99.75,25.88 98.5,25.88 95.25,29.12 95.25,30.12 94.62,30.75 80.75,30.75 80.38,30.38 77.12,30.38 76.75,30.75 36.75,30.75 31.75,25.75 27.88,25.75 22.88,30.75 21.5,30.75 20.75,30 20.75,29 16.88,25.12 13.88,25.12 13.12,24.38 13.12,14.75 v16.62,11.25 | v6,9.62 6.12,9.5 6.12,7.75 6.05,7.83 R79.2
N$82  (via drill 0.61)
  Top 0.305: v106.38,49.62 106.38,49.62 106.38,52.7 103.67,55.5 DPL4.K 94,55.5
  Bottom 0.305: IC4.9 104.69,47.95 v106.38,49.62
N$83
  Bottom 0.305: DL3.2 40.17,47.53 R3.1
N$84
  Bottom 0.305: DL4.2 94.17,48.47 R4.2
N$85
  Bottom 0.305: R19.1 35.75,39 34.42,40.33 IC3.15
N$86
  Bottom 0.305: DL13.K 86.27,6.75 89,6.75 89.3,6.45 IC2.7
N$87
  Bottom 0.305: R20.1 107.75,39 106.42,40.33 IC4.15
N$88
  Bottom 0.305: R21.1 35.75,13 34.42,14.32 IC5.15
N$89
  Bottom 0.305: R22.1 71.75,13 70.42,14.32 IC6.15
N$90
  Bottom 0.305: DL14.K 88.02,5.11 | 88.02,5.11 88,5.12 | 88.02,5.11 IC2.8
N$91  (via drill 0.61)
  Top 0.305: 94,2.48 DL16.K 92.77,3.75 88.88,3.75 88,4.62 v88,12.5
  Bottom 0.305: v88,12.5 88,10.5 | IC2.9 88,10.5 | 88,10.25 88,10.38 88,10.5
N$92  (via drill 0.61)
  Top 0.305: DL17.K 100,2.6 100,2.62 98.25,4.38 90,4.38 89.25,5.12 v89.25,13.38
  Bottom 0.305: v89.25,13.38 89.25,10.5 89.27,10.52 IC2.10
N$93
  Top 0.305: 82.25,28.12 83.38,28.12 | 83.38,28.12 83.38,29.12 84.38,28.12 | 84.38,28.12 83.38,27.12 83.38,28.12 | 84.38,29.12 84.38,28.12 | 84.38,28.12 84.38,27.12 | 84.38,28.12 85.5,28.12
N$94
  Bottom 0.305: 82.25,28.12 83.38,28.12 | 83.38,28.12 83.38,27.12 84.38,28.12 | 84.38,28.12 83.38,29.12 83.38,28.12 | 84.38,27.12 84.38,28.12 | 84.38,28.12 84.38,29.12 | 84.38,28.12 85.5,28.12
N$95
  Top 0.305: 63.94,32.34 65.06,32.34 | 65.06,32.34 65.06,33.34 66.06,32.34 | 66.06,32.34 65.06,31.34 65.06,32.34 | 66.06,33.34 66.06,32.34 | 66.06,32.34 66.06,31.34 | 66.06,32.34 67.19,32.34
N$96
  Bottom 0.305: 44.25,26.62 45.38,26.62 | 45.38,26.62 45.38,25.62 46.38,26.62 | 46.38,26.62 45.38,27.62 45.38,26.62 | 46.38,25.62 46.38,26.62 | 46.38,26.62 46.38,27.62 | 46.38,26.62 47.5,26.62
N$97
  Top 0.305: 30.75,5.62 31.88,5.62 | 31.88,5.62 31.88,6.62 32.88,5.62 | 32.88,5.62 31.88,4.62 31.88,5.62 | 32.88,6.62 32.88,5.62 | 32.88,5.62 32.88,4.62 | 32.88,5.62 34,5.62
N$98
  Bottom 0.305: 30.75,5.62 31.88,5.62 | 31.88,5.62 31.88,4.62 32.88,5.62 | 32.88,5.62 31.88,6.62 31.88,5.62 | 32.88,4.62 32.88,5.62 | 32.88,5.62 32.88,6.62 | 32.88,5.62 34,5.62
N$99  (via drill 0.61)
  Top 0.305: v80.38,25.62 76.5,29.5 DPL8.K 76,29.5
  Bottom 0.305: IC6.9 68.69,21.95 72.38,25.62 v80.38,25.62
N$100
  Bottom 0.305: R7.1 58.17,22.47 DL7.2
N$101
  Bottom 0.305: DL8.2 76.17,21.53 R8.2
N$128
  Top 0.305: 103.25,2.12 104.38,2.12 | 104.38,2.12 104.38,3.12 105.38,2.12 | 105.38,2.12 104.38,1.12 104.38,2.12 | 105.38,3.12 105.38,2.12 | 105.38,2.12 105.38,1.12 | 105.38,2.12 106.5,2.12
N$129  (1 unrouted)
  Bottom 0.305: 118.38,42.5 118.38,25.12 | 116.12,42.5 116.12,25.12
N$130
  Bottom 0.61: C28.2 R51.1
N$131
  Bottom 0.305: 103.25,2.12 104.38,2.12 | 104.38,2.12 104.38,1.12 105.38,2.12 | 105.38,2.12 104.38,3.12 104.38,2.12 | 105.38,1.12 105.38,2.12 | 105.38,2.12 105.38,3.12 | 105.38,2.12 106.5,2.12
N$132
  Top 0.305: 114.75,52.12 115.88,52.12 | 115.88,52.12 115.88,53.12 116.88,52.12 | 116.88,52.12 115.88,51.12 115.88,52.12 | 116.88,53.12 116.88,52.12 | 116.88,52.12 116.88,51.12 | 116.88,52.12 118,52.12
N$133
  Bottom 0.305: 114.75,52.12 115.88,52.12 | 115.88,52.12 115.88,51.12 116.88,52.12 | 116.88,52.12 115.88,53.12 115.88,52.12 | 116.88,51.12 116.88,52.12 | 116.88,52.12 116.88,53.12 | 116.88,52.12 118,52.12
N$134
  Top 0.305: 14.12,54.88 15.25,54.88 | 15.25,54.88 15.25,55.88 16.25,54.88 | 16.25,54.88 15.25,53.88 15.25,54.88 | 16.25,55.88 16.25,54.88 | 16.25,54.88 16.25,53.88 | 16.25,54.88 17.38,54.88
N$135
  Bottom 0.305: 14.12,54.88 15.25,54.88 | 15.25,54.88 15.25,53.88 16.25,54.88 | 16.25,54.88 15.25,55.88 15.25,54.88 | 16.25,53.88 16.25,54.88 | 16.25,54.88 16.25,55.88 | 16.25,54.88 17.38,54.88
N$158
  Bottom 0.305: SJ3.2 30.5,14.26 30.5,14.5 31.59,15.6 IC5.14 34.16,15.6 35.42,14.32 49.62,14.25 50.62,15.25 54.12,15.25 55.05,14.32 IC6.2 63.13,14.25 SJ4.3
N$298
  Bottom 0.254: 119.45,57.43 119.45,54.25 113.74,54.25 113.74,57.43 119.45,57.43
N$312
  Top 0.254: 119.51,53.95 119.51,57.12 113.8,57.12 113.8,53.95 119.51,53.95
N$317
  Top 0.305: 86.38,56.5 87.5,56.5 | 87.5,56.5 87.5,57.5 88.5,56.5 | 88.5,56.5 87.5,55.5 87.5,56.5 | 88.5,57.5 88.5,56.5 | 88.5,56.5 88.5,55.5 | 88.5,56.5 89.62,56.5
N$334  (via drill 0.61)
  Top 0.305: v110.88,51.12 110.88,49.62 115.88,44.62 115.88,25.12 v115,24.25 | v43,24.25 43,33.38 46.75,37.12 46.75,46.38 41.5,51.62 v39,51.62 v37.25,49.75 | v15.12,47.38 15.88,46.62 15.88,30.62 16.25,30.25 16.25,27.38 15.88,27 v15.88,23.38 | v2.25,4 3.38,2.88 6.38,2.88 10.12,6.62 15.5,6.62 19.25,10.38 v19.25,11.38 | v87.88,23.38 87.88,35.88 88.25,36.25 88.25,38 87.88,38.38 v87.88,45.5 88.38,45.5 91.25,48.38 v91.25,49
  Bottom 0.305: 109.35,48.51 R2.1 | R8.1 73.26,22.5 73.25,22.51 73.25,23.12 74.38,24.25 79,24.25 80.62,22.62 82.5,22.62 | R7.2 55.42,23.38 55.12,23.38 | v87.88,45.5 87.62,45.75 87.62,47.62 87.62,48.5 87.62,48.55 89.8,50.73 96.58,50.73 98.18,52.33 103.94,52.33 105.52,50.75 109.38,50.75 | 109.38,50.75 110.88,50.75 v110.88,51.12 | 109.35,48.51 109.38,48.54 109.38,50.75 | 20.2,50.73 25.45,50.73 26.43,51.71 38.54,51.71 38.75,51.5 38.88,51.5 v39,51.62 | R1.2 20.3,50.67 20.2,50.73 | R3.2 37.35,48.51 37.38,48.54 | R6.1 37.26,22.5 37.25,22.51 37.25,23.12 38.38,24.25 v43,24.25 44.62,22.62 51.12,22.62 51.88,23.38 55.12,23.38 | 20.2,50.73 17.18,50.73 15.12,48.67 15.12,48.63 15.12,48.62 v15.12,47.38 | R5.2 19.42,23.38 v15.88,23.38 15.88,23.25 15.38,22.75 15.38,21.12 16.25,20.25 16.25,14.38 v19.25,11.38 | R26.1 9.08,5 3.25,5 v2.25,4 | R12.1 109.26,22.5 109.25,22.51 109.25,23.12 110.38,24.25 v115,24.25 | R11.2 91.42,23.38 v87.88,23.38 87.12,22.62 82.5,22.62 | R3.2 37.3,49.7 v37.25,49.75 | 55.12,23.38 58,26.25 79.38,26.25 79.75,26.62 81,26.62 82.38,25.25 82.38,22.75 82.5,22.62 | R2.1 109.34,48.5 109.35,48.51 | R4.1 91.75,48.5 v91.25,49 | R3.2
N$369  (via drill 0.61)
  Top 0.305: v30.5,42 33.12,42 37.62,37.5 v37.62,33.25 37.38,33.25 34.62,30.5 34.62,24.38 32.75,22.5 32.75,18.12 v30.5,15.88 33.12,15.88 36.25,12.75 36.25,11.25 35,10 22.12,10 19.75,12.38 11.38,12.38 7.5,16.25 7.5,25.12 8.5,26.12 v8.5,29.5 | 102.75,42.25 v102.5,42 105.12,42 109.62,37.5 v109.62,33.25 106.25,29.88 106.25,24 104.75,22.5 104.75,18.12 v102.5,15.88 105.25,15.88 108.25,12.88 108.25,11 103.88,6.62 98.5,6.62 97.25,5.38 92.88,5.38 91.75,6.5 v91.75,8.38 | v106.12,32.88 104.75,34.25 100.25,34.25 98.12,32.12 v97.75,32.12 | v73.75,33.12 73.5,33.12 70.26,29.89 70.26,24.01 68.75,22.5 68.75,18.12 v66.5,15.88 69.25,15.88 72.25,12.88 72.25,10.5 68.38,6.62 62.25,6.62 61.25,5.62 56.75,5.62 55.62,6.75 v55.62,8.25
  Bottom 0.305: IC6.13 66.86,16.86 66.5,16.5 v66.5,15.88 | IC4.13 102.86,42.87 102.5,42.5 v102.5,42 | v109.62,33.25 109.62,33.62 109.5,33.62 108.5,32.62 106.38,32.62 v106.12,32.88 | IC5.13 30.87,16.86 30.5,16.5 v30.5,15.88 | IC3.13 30.87,42.87 30.5,42.5 v30.5,42 | 37.5,33.62 37.62,33.62 | 37.62,33.62 42.25,33.62 43.25,32.62 53,32.62 53.88,33.5 57.88,33.5 58.75,32.62 73.25,32.62 v73.75,33.12 80.5,33.12 81,32.62 88.62,32.62 89.5,33.5 92.88,33.5 93.75,32.62 97.25,32.62 v97.75,32.12 | v37.62,33.25 37.62,33.62 | PIC1.23 10.85,29.5 v8.5,29.5 | IC7.13 102.86,16.86 102.5,16.5 v102.5,15.88 | IC1.13 57.11,9.27 57.12,9.25 57.12,9.12 56.25,8.25 v55.62,8.25 | IC2.13 93.11,9.11 92.5,8.5 91.88,8.5 v91.75,8.38
N$TEQV1  (1 unrouted)
  Top 0.305: 84.35,57.19 84.35,32.07 | 81.35,57.19 81.35,32.07
SCK1  (via drill 0.61)
  Top 0.305: 63.62,52.84 CN_SYSTEM.7 CN_SYSTEM.8 | CN_SYSTEM.8 61.25,57.75 12,57.75 9.62,55.38 2.38,55.38 0.88,53.88 0.88,46.12 v1,46 | CN_SYSTEM.8 63.62,55.38
  Bottom 0.305: 10.91,26.88 PIC1.25 8.86,26.89 5.62,30.12 5.62,39 4.62,40 4.62,42.12 2.75,44 2.75,44.25 v1,46 | R14.1 57.49,48.58 60.34,51.44 62.15,51.44 CN_SYSTEM.7
SCK3  (via drill 0.61)
  Top 0.305: v97.38,41.38 94,38 v94,33.75 94,31.5 95.38,30.12 95.38,25.25 97.88,22.75 97.88,21.5 97.38,21 v97.38,15.62 94.38,12.62 v94.38,8.12 | v25.38,15.62 25.38,21 25.88,21.5 25.88,22.62 23.5,25 v23.5,33.38 23.5,40 v25.09,41.59 25.12,41.62 | v58.38,8.38 58.38,12.62 v61.38,15.62 61.38,19.09 59.08,21.39 59.08,23.18 59.5,23.6 v59.5,33.75
  Bottom 0.305: IC4.3 97.59,41.59 v97.38,41.38 | 94.13,33.6 93.5,34.1 | IC6.3 63.03,15.62 v61.38,15.62 | v94,33.75 93.5,34.1 | 93.5,34.1 93.47,34.12 89.25,34.12 88.5,33.38 81.12,33.38 80.75,33.75 75.5,33.75 74.75,34.5 73.5,34.5 72.25,33.25 60,33.25 v59.5,33.75 59.5,34.1 | IC3.3 v25.09,41.59 | 23.5,33.35 23.38,33.47 23.73,33.12 25.23,31.61 25.25,29.25 28,26.5 31.5,26.5 36.38,31.25 36.38,33.38 37.25,34.25 42.5,34.25 43.39,33.36 52.74,33.36 53.5,34.12 59.47,34.12 59.5,34.1 | IC5.3 27.02,15.62 v25.38,15.62 | 23.5,33.35 v23.5,33.38 23.25,33.5 20.62,30.88 18.5,30.88 13.24,25.62 PIC1.26 | 23.5,33.35 23.47,33.38 | 59.63,34.1 59.5,34.1 | IC7.3 99.03,15.62 v97.38,15.62 | IC1.3 v58.38,8.37 v58.38,8.38 | IC2.3 v94.38,8.12
SDI1  (via drill 0.61)
  Top 0.305: CN_SYSTEM.12 CN_SYSTEM.11 | v1.75,40.38 2.62,40.38 3.88,41.62 3.88,47.62 v3.62,47.88 3.25,48.25 3.25,48.62 4.62,50 5.62,50 6.5,49.12 6.5,44.12 7.75,42.88 8.88,42.88 10.5,44.5 10.48,44.5 PROG.4
  Bottom 0.305: PIC1.14 1.52,40.23 v1.75,40.38 | 58.5,55.42 CN_SYSTEM.12 58.5,55.38 56.62,57.38 12.12,57.38 9.75,55 3.12,55 2.5,54.38 2.5,49 v3.62,47.88
SDI3  (via drill 0.61)
  Top 0.305: v107.75,51.8 107.75,48.75 107,48 SW2.G1 106.75,47.81 106.75,43 107.75,42 110,42 112.62,39.38 v112.62,32 112,31.38 109.5,31.38 107.5,29.38 107.5,22.56 SW10.G1 | SW8.G1 71.5,22.56 71.5,29.38 73.12,31 79.25,31 v79.75,31.5 | v35.75,52.8 35,52 35,48 SW3.G1 34.75,47.81 34.75,43 36.5,41.25 38.75,41.25 40.5,39.5 | SW6.G1 36.12,23.18 36.12,30 37.38,31.25 40,31.25 40.62,31.88 40.62,39.38 40.5,39.5 | 16.94,22.07 16.94,32.87 | 16.94,22.07 16.88,22 | 16.94,22.07 SW5.G1 | SW7.G1 52.94,22.07 52.88,22 52.88,30 v54.75,31.88 | 16.94,32.87 SW1.G1 16.94,52.06 v16.75,52.25 13.62,52.25 11.75,50.38 11.75,50.25 | 11.75,50.25 11.12,50.88 9.25,50.88 7.38,52.62 v4.88,52.62 | 11.75,50.25 11.75,43.38 10.38,42 10.44,41.94 PROG.5 | v41.12,40.25 40.5,39.62 40.5,39.5 | 16.94,32.87 16.94,32.88 | v86.25,47.88 88.88,47.88 88.94,47.94 | 88.94,47.94 89,48 | SW9.G1 88.94,30.57 v90.25,31.88 | SW4.G1 88.94,47.94
  Bottom 0.305: 44.25,51 42.62,52.62 35.75,52.62 | 107.75,52.25 105,52.25 104.25,53 97.88,53 96.25,51.38 89.53,51.38 86.5,48.34 86.5,48.12 | 107.75,52.25 107.92,52.16 | v107.75,51.8 107.75,52.25 | v16.75,52.25 25.88,52.25 26.25,52.62 35.75,52.62 | 35.75,52.62 35.79,52.79 | v35.75,52.8 35.75,52.62 | PIC1.15 10.92,41.45 10.44,41.94 | R27.2 6.05,52.62 v4.88,52.62 | PROG.5 10.44,41.94 | 10.44,41.94 10.38,42 | v112.62,32 112,31.38 108.62,31.38 107.5,30.25 107.5,28.38 105.25,26.12 100.38,26.12 100,26.5 98.75,26.5 95.88,29.38 95.88,30.38 94.88,31.38 90.25,31.38 | 90.25,31.38 80.38,31.38 80,31 79.75,31 | 79.75,31 77.38,31 77,31.38 54.75,31.38 | 54.75,31.38 40.75,31.38 | 86.5,48.12 86.5,44.88 82.62,41 49.75,41 48.62,42.12 44,42.12 42.5,40.62 41.5,40.62 v41.12,40.25 | v79.75,31.5 79.75,31 | v54.75,31.88 54.75,31.38 | 86.5,48.12 v86.25,47.88 | v90.25,31.88 90.25,31.38
SDO1
  Top 0.305: 61.05,52.58 CN_SYSTEM.9 CN_SYSTEM.10
  Bottom 0.305: PIC1.24 10.83,28.25 8.38,28.25 6.25,30.38 6.25,39.25 5.25,40.25 5.25,42.38 3.38,44.25 3.38,45.62 1.88,47.12 1.88,54.62 2.88,55.62 9.5,55.62 11.88,58 58.38,58 61,55.38 61.01,55.38 CN_SYSTEM.10
SDO2
  Bottom 0.305: IC1.14 58.38,11.62 56.38,13.62 54.88,13.62 53.88,14.62 52.12,14.62 47.38,9.88 26.62,9.88 24.12,12.38 24.12,13.5 25,14.38 27,14.38 IC5.2 28.91,14.32 SJ3.3
SS1
  Top 0.305: CN_SYSTEM.13 CN_SYSTEM.14
  Bottom 0.305: PIC1.16 10.87,38.38 9.88,38.38 9.38,38.88 9.38,40.5 9.12,40.75 9.12,53.5 12.38,56.75 54.75,56.75 56,55.38 CN_SYSTEM.14
SS3  (via drill 0.61)
  Top 0.305: 35.62,11.62 35.62,12.5 33.38,14.75 30.25,14.75 29.25,15.75 v29.25,17.38 29.25,18.25 31.25,20.25 31.25,24.38 34,27.12 34,30.88 35.88,32.75 35.88,34.75 | 35.88,34.75 35.88,38.25 33.88,40.12 30.75,40.12 29.38,41.62 v29.38,43.5 28.88,43 25,43 22,40 v22,35.12 | 101.38,43.75 v101.62,43.5 101.62,42.88 101.38,42.62 101.38,41.62 104.25,38.75 107.38,38.75 108.38,37.75 108.38,35.38 108,35 108,34.5 | 65.88,18.38 65.81,18.31 | 65.81,18.31 64.88,17.38 64.88,15.25 66.62,13.5 70.75,13.5 71.62,12.62 71.62,11.38 67.62,7.38 62,7.38 60.88,6.25 57.75,6.25 v57.12,6.88 | v36,34.5 35.88,34.75 | 65.81,18.31 v65.88,18.25 67.01,19.39 67.01,26.04 69.55,28.57 69.55,32.55 71.5,34.5 v72,34.5 | 101.88,18.38 101.81,18.31 | 101.81,18.31 100.88,17.38 100.88,15.25 102.62,13.5 106.5,13.5 107.62,12.38 107.62,11.5 103.88,7.75 98.5,7.75 96.75,6 94,6 v93.12,6.88 | 101.81,18.31 v101.88,18.25 103.25,19.62 103.25,26.38 105.62,28.75 105.62,30.12 108,32.5 108,34.5 | 108,34.5 107.88,34.38 105.88,34.38 105.38,34.88 99.5,34.88 v98.25,33.62
  Bottom 0.305: IC6.4 64.49,16.86 v65.88,18.25 | IC4.4 100.99,42.87 v101.62,43.5 | IC3.4 28.74,42.87 v29.38,43.5 | IC5.4 28.74,16.86 v29.25,17.38 | v36,34.5 36.38,34.88 42.75,34.88 43.62,34 52.38,34 53.12,34.75 59.88,34.75 60.75,33.88 71.38,33.88 v72,34.5 72.62,35.12 75,35.12 75.75,34.38 81,34.38 81.38,34 88.25,34 89,34.75 95.88,34.75 96.75,33.88 98.25,33.88 v98.25,33.62 | 10.89,32 PIC1.21 13.75,32 15,32 16,33 19.88,33 v22,35.12 | IC7.4 100.49,16.86 v101.88,18.25 | IC1.4 57.11,6.86 v57.12,6.88 | IC2.4 93.12,5.15 v93.12,6.88
(copper drawn outside any net)
  shapes: Bottom area x2, Bottom circle x3, Top circle x6

## Text on the board
Top: A 10db 3mm körüli kört is kell kontúrmarni, vagy fúrni! | TEQ NARVAL 2016 | 7 | 9 | MTX6BR V2 | Top | 10 | 8 | 7+8 | 9+10
Bottom: 10 | Bot | 9 | 8 | 7 | TEQ NARVAL 2016 | MTX6BR V2
tNames: Int Rc Tx Ss So Si Sc 12 5 G
bNames: G 5 12 Sc Si So Ss Tx Rx Int